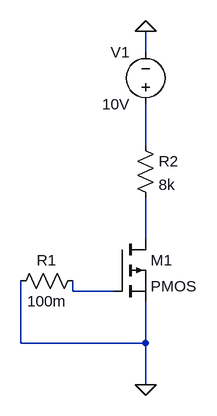
[diagram p0: schematic Draft1.asc]
Draft1.asc, the LTspice schematic file:
Version 4
SHEET 1 880 680
WIRE 288 -176 288 -208
WIRE 288 -32 288 -96
WIRE 288 112 288 48
WIRE 176 192 176 176
WIRE 240 192 176 192
WIRE 96 272 96 176
WIRE 288 272 288 208
WIRE 288 272 96 272
WIRE 288 336 288 272
FLAG 288 336 0
FLAG 288 -208 0
SYMBOL res 192 160 R90
WINDOW 0 0 56 VBottom 2
WINDOW 3 32 56 VTop 2
SYMATTR InstName R1
SYMATTR Value 100m
SYMBOL res 272 -48 R0
SYMATTR InstName R2
SYMATTR Value 8k
SYMBOL voltage 288 -80 R180
WINDOW 0 24 96 Left 2
WINDOW 3 24 16 Left 2
WINDOW 123 0 0 Left 2
WINDOW 39 0 0 Left 2
SYMATTR InstName V1
SYMATTR Value 10V
SYMBOL pmos 240 112 R0
SYMATTR InstName M1

The netlist it stands for:
* Draft1.asc
R1 N003 0 100m
R2 N001 N002 8k
V1 N001 0 10V
M1 N002 N003 0 0 PMOS
.model NMOS NMOS
.model PMOS PMOS
.lib standard.mos
.backanno
.end